# EAGLE schematic top_schematic (EAGLE 6.6.0)
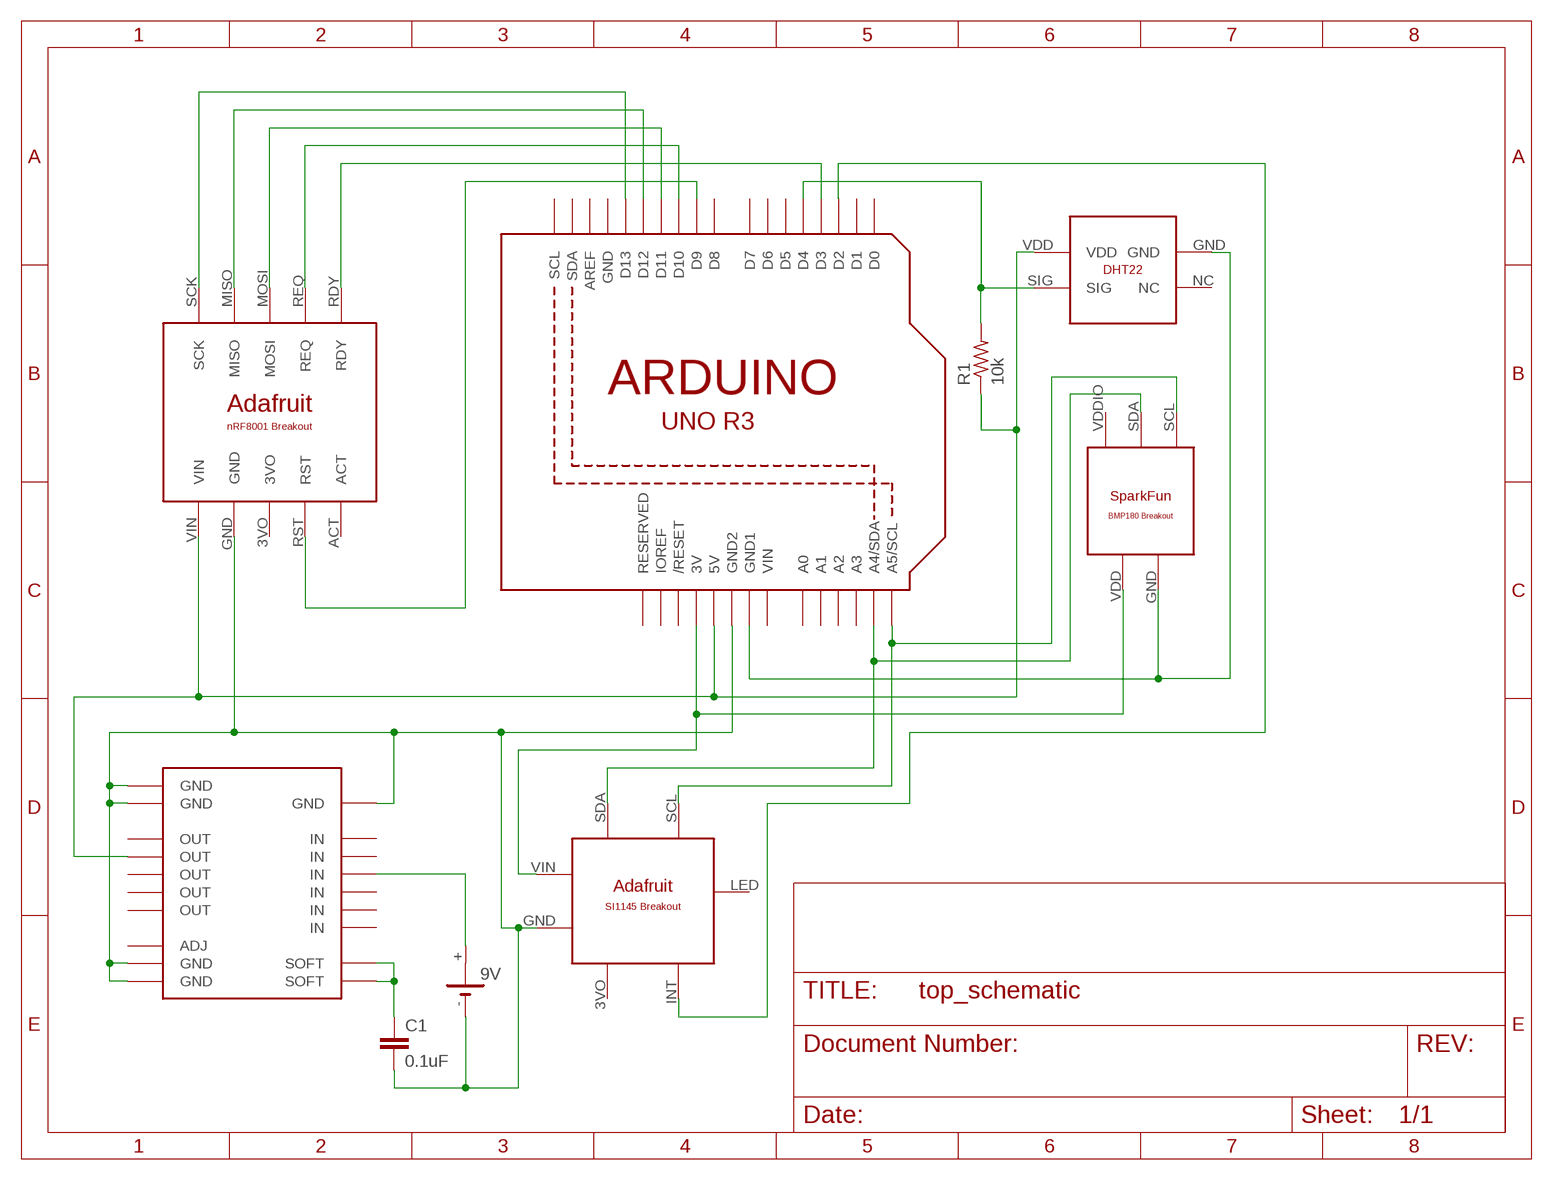
[diagram p0: schematic, sheet 1]

## Parts
9V  1V60R  [1V60R]
C1  0.1uF  CXXC10B5  [XC10B5]
R1  10k  R-US_R0402  [R0402]
U1  ARDUINOR3-DIMENSION  [ARDUINOR3]
U$1  ADAFRUIT_NRF8001_BREAKOUT  [ADAFRUIT_NRF8001_BREAKOUT_HEADERS]
U$2  SPARKFUN_BMP180_BREAKOUT  [SPARKFUN_BMP180_BREAKOUT_HEADERS]
U$3  DHT22  [DHT22_HEADERS]
U$4  ADAFRUIT_SI1145_BREAKOUT  [ADAFRUIT_SI1145_BREAKOUT_HEADERS]
U$5  TI_LM2825  [TI_LM2825_HEADERS]

## Nets
3V: U1.3V U$2.VDD U$4.VIN
GND: U1.GND1 U$2.GND U$3.GND
N$1: 9V.+ U$5.IN@19(IN)
N$2: U1.A4(A4/SDA) U$2.SDA U$4.SDA
N$3: U1.D2 U$4.INT
N$5: U1.D13 U$1.SCK
N$6: U1.D12 U$1.MISO
N$7: U1.D11 U$1.MOSI
N$8: U1.D10 U$1.REQ
N$9: U1.D3 U$1.RDY
N$10: U1.D9 U$1.RST
N$12: U1.A5(A5/SCL) U$2.SCL U$4.SCL
N$14: R1.2 U1.D4 U$3.SIG
N$15: C1.1 U$5.SOFT@13(SOFT) U$5.SOFT@14(SOFT)
N$16: 9V.- C1.2 U1.GND2 U$1.GND U$4.GND U$5.GND@1(GND) U$5.GND@2(GND) U$5.GND@11(GND) U$5.GND@12(GND) U$5.GND@23(GND)
VDD: R1.1 U1.5V U$1.VIN U$3.VDD U$5.OUT@5(OUT)
Unconnected: 9V.+@1(+) U1.A0 U1.A1 U1.A2 U1.A3 U1.AREF U1.D0 U1.D1 U1.D5 U1.D6 U1.D7 U1.D8 U1.IOREF U1.RESERVED U1.RESET(/RESET) U1.SCL U1.SDA U$1.3VO U$1.ACT U$2.VDDIO U$3.NC U$4.LED U$5.ADJ U$5.IN@16(IN) U$5.IN@17(IN) U$5.IN@18(IN) U$5.IN@20(IN) U$5.IN@21(IN) U$5.OUT@4(OUT) U$5.OUT@6(OUT) U$5.OUT@7(OUT) U$5.OUT@8(OUT)

## Power pins joined to a net without a drawn wire
3VO: U$4.3VO
GND: U1.GND
VIN: U1.VIN

## Library data of the parts
9V = battery:1V60R: NC ACCU Varta
C1 = rcl:CX: X CAPACITOR for power line
R1 = rcl:R-US_: RESISTOR, American symbol
U1 = adafruit:ARDUINOR3: This is a new object for the new Arduino R3 - with extra pins that you may want to use (such as IOref, and duplicated A4/A5
U$1 = parts:ADAFRUIT_NRF8001_BREAKOUT
U$2 = parts:SPARKFUN_BMP180_BREAKOUT
U$3 = Bluetooth_sensor_parts:DHT22
U$4 = BLE_sensor_parts:ADAFRUIT_SI1145_BREAKOUT
U$5 = BLE_sensor_pack_parts:TI_LM2825